# Altium schematic sheet P5_ACCEL.SchDoc
size A
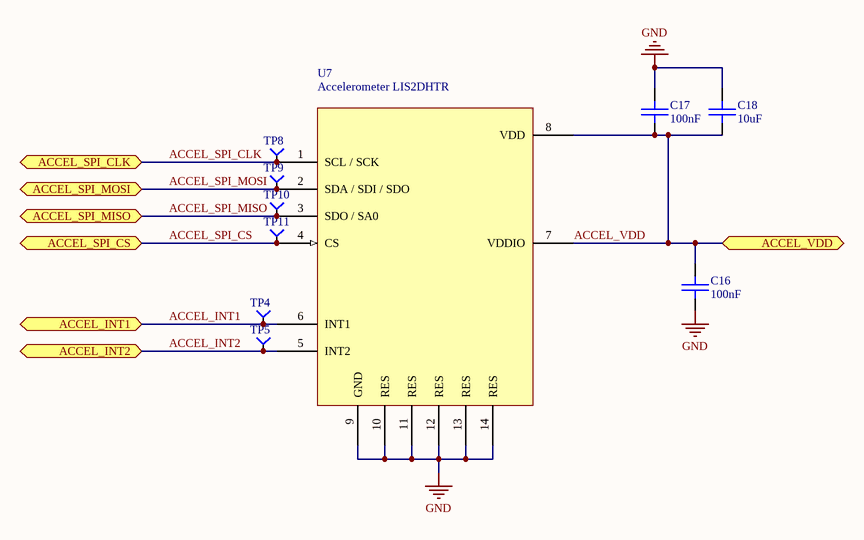
[diagram p0: P5_ACCEL.SchDoc]

## Parts
C16  value 100nF  [CAPC0201(0603)_N]  (hidden comment: CAP CER 0.1UF 10V 10% X5R 0201)
C17  value 100nF  [CAPC0201(0603)_N]  (hidden comment: CAP CER 0.1UF 10V 10% X5R 0201)
C18  value 10uF  [CAPC0603(1608)_N]  (hidden comment: CAP CER 10UF 6.3V 20% X5R 0603)
TP4  TEST POINT 5MILx20MIL  [SMT_TP_5milx20mil]  (value not drawn)
TP5  TEST POINT 5MILx20MIL  [SMT_TP_5milx20mil]  (value not drawn)
TP8  TEST POINT 5MILx20MIL  [SMT_TP_5milx20mil]  (value not drawn)
TP9  TEST POINT 5MILx20MIL  [SMT_TP_5milx20mil]  (value not drawn)
TP10  TEST POINT 5MILx20MIL  [SMT_TP_5milx20mil]  (value not drawn)
TP11  TEST POINT 5MILx20MIL  [SMT_TP_5milx20mil]  (value not drawn)
U7  Accelerometer LIS2DHTR  [LGA14N]

## Ports
ACCEL_INT1, ACCEL_INT2, ACCEL_SPI_CLK, ACCEL_SPI_CS, ACCEL_SPI_MISO, ACCEL_SPI_MOSI, ACCEL_VDD

## Nets
GND: C16.1 C17.2 C18.2 U7.9(GND) U7.10(RES) U7.11(RES) U7.12(RES) U7.13(RES) U7.14(RES)
ACCEL_INT1: TP4.1(TP) U7.6(INT1) ; port ACCEL_INT1
ACCEL_INT2: TP5.1(TP) U7.5(INT2) ; port ACCEL_INT2
ACCEL_SPI_CLK: TP8.1(TP) U7.1(SCL_/_SCK) ; port ACCEL_SPI_CLK
ACCEL_SPI_CS: TP11.1(TP) U7.4(CS) ; port ACCEL_SPI_CS
ACCEL_SPI_MISO: TP10.1(TP) U7.3(SDO_/_SA0) ; port ACCEL_SPI_MISO
ACCEL_SPI_MOSI: TP9.1(TP) U7.2(SDA_/_SDI_/_SDO) ; port ACCEL_SPI_MOSI
ACCEL_VDD: C16.2 C17.1 C18.1 U7.7(VDDIO) U7.8(VDD) ; port ACCEL_VDD

## Library data of the parts
C16 C17 = 03-02751-000: Manufacturer 1: Murata Electronics North America; Manufacturer Item 1: GRM033R61A104KE15D; Case EIA: 201; Case Metric: 603; Tolerance: +/-10%; Legacy Item Number: C02498; Temperature Coefficient: X5R; RoHS: Y; Voltage Rating: 10V; Manufacturer 2: TDK Corporation; Item Number: 03-02751-000; Item Name: CAP CER 0.1UF 10V 10% X5R 0201; Lifecycle: Design; Manufacturer Item 2: LMK063BJ104KP-F; Link to Arena Files: https://app.bom.com/a/UCV4A5O5O77U844W?v=files.associations; Manufacturer Part Number 1: GRM033R61A104KE15D; Manufacturer Part Number 2: C0603X5R1A104K030BC; Revision: 1; Supplier 1: Avnet; Supplier 2: Avnet; Supplier Part Number 1: GRM033R61A104KE15D; Supplier Part Number 2: C0603X5R1A104K030BC
C18 = 03-01465-000: Manufacturer 1: NIC Components; Manufacturer Item 1: QM036D106MAT2A; Manufacturer Part Number 1: NMC0603X5R106M6.3TRP4KF; Case EIA: 603; Case Metric: 1608; Tolerance: +/-20%; Legacy Item Number: C04812; Temperature Coefficient: X5R; RoHS: Y; Voltage Rating: 6.3V; Item Number: 03-01465-000; Item Name: CAP CER 10UF 6.3V 20% X5R 0603; Lifecycle: Design; Link to Arena Files: https://app.bom.com/a/0I1AGBUBUDD0EBBR?v=files.associations; Manufacturer 2: Samsung Electro-Mechanics America Inc; Manufacturer Item 2: 06036D106MAT2A; Manufacturer 3: AVX Corporation; Manufacturer 4: Kemet; Manufacturer Part Number 2: CL10A106MQ8NNNC; Manufacturer Part Number 3: 06036D106MAT2A; Manufacturer Part Number 4: C0603C106M9PACTU; Revision: 1; Supplier 1: Avnet; Supplier 2: Avnet; Supplier 3: Digi-key; Supplier 4: Digi-key; Supplier Part Number 1: NMC0603X5R106M6.3TRP4KF; Supplier Part Number 2: CL10A106MQ8NNNC; Supplier Part Number 3: 478-5318-1-ND; Supplier Part Number 4: 399-5504-1-ND
TP4 TP5 TP8-TP11 = 03-07196-000: Test Point; Legacy Item Number: X01020; Item Name: TP SMT 5 x 20mil; RoHS: Y; Item Number: 03-07196-000; Lifecycle: Preliminary; Link to Arena Files: https://app.bom.com/a/3L4DJEXEXGG343DZ?v=files.associations
U7 = 03-07192-000: STMicro 3-axis accelerometer; Legacy Item Number: U01014; Package / Case: LGA14; RoHS: Y; Manufacturer 1: STMicro; Item Number: 03-07192-000; Item Name: Accelerometer LIS2DHTR; Lifecycle: Design; Manufacturer Item 1: LIS2DHTR; Link to Arena Files: https://app.bom.com/a/7P8HNI1I1KK7K9QH?v=files.associations; Manufacturer Part Number 1: LIS2DHTR; Revision: 1; Supplier 1: Digi-key; Supplier Part Number 1: 497-13795-2-ND